# EAGLE design BASIS-RJ45-1.1 (EAGLE 7.4.0)
Selectrix Arduino
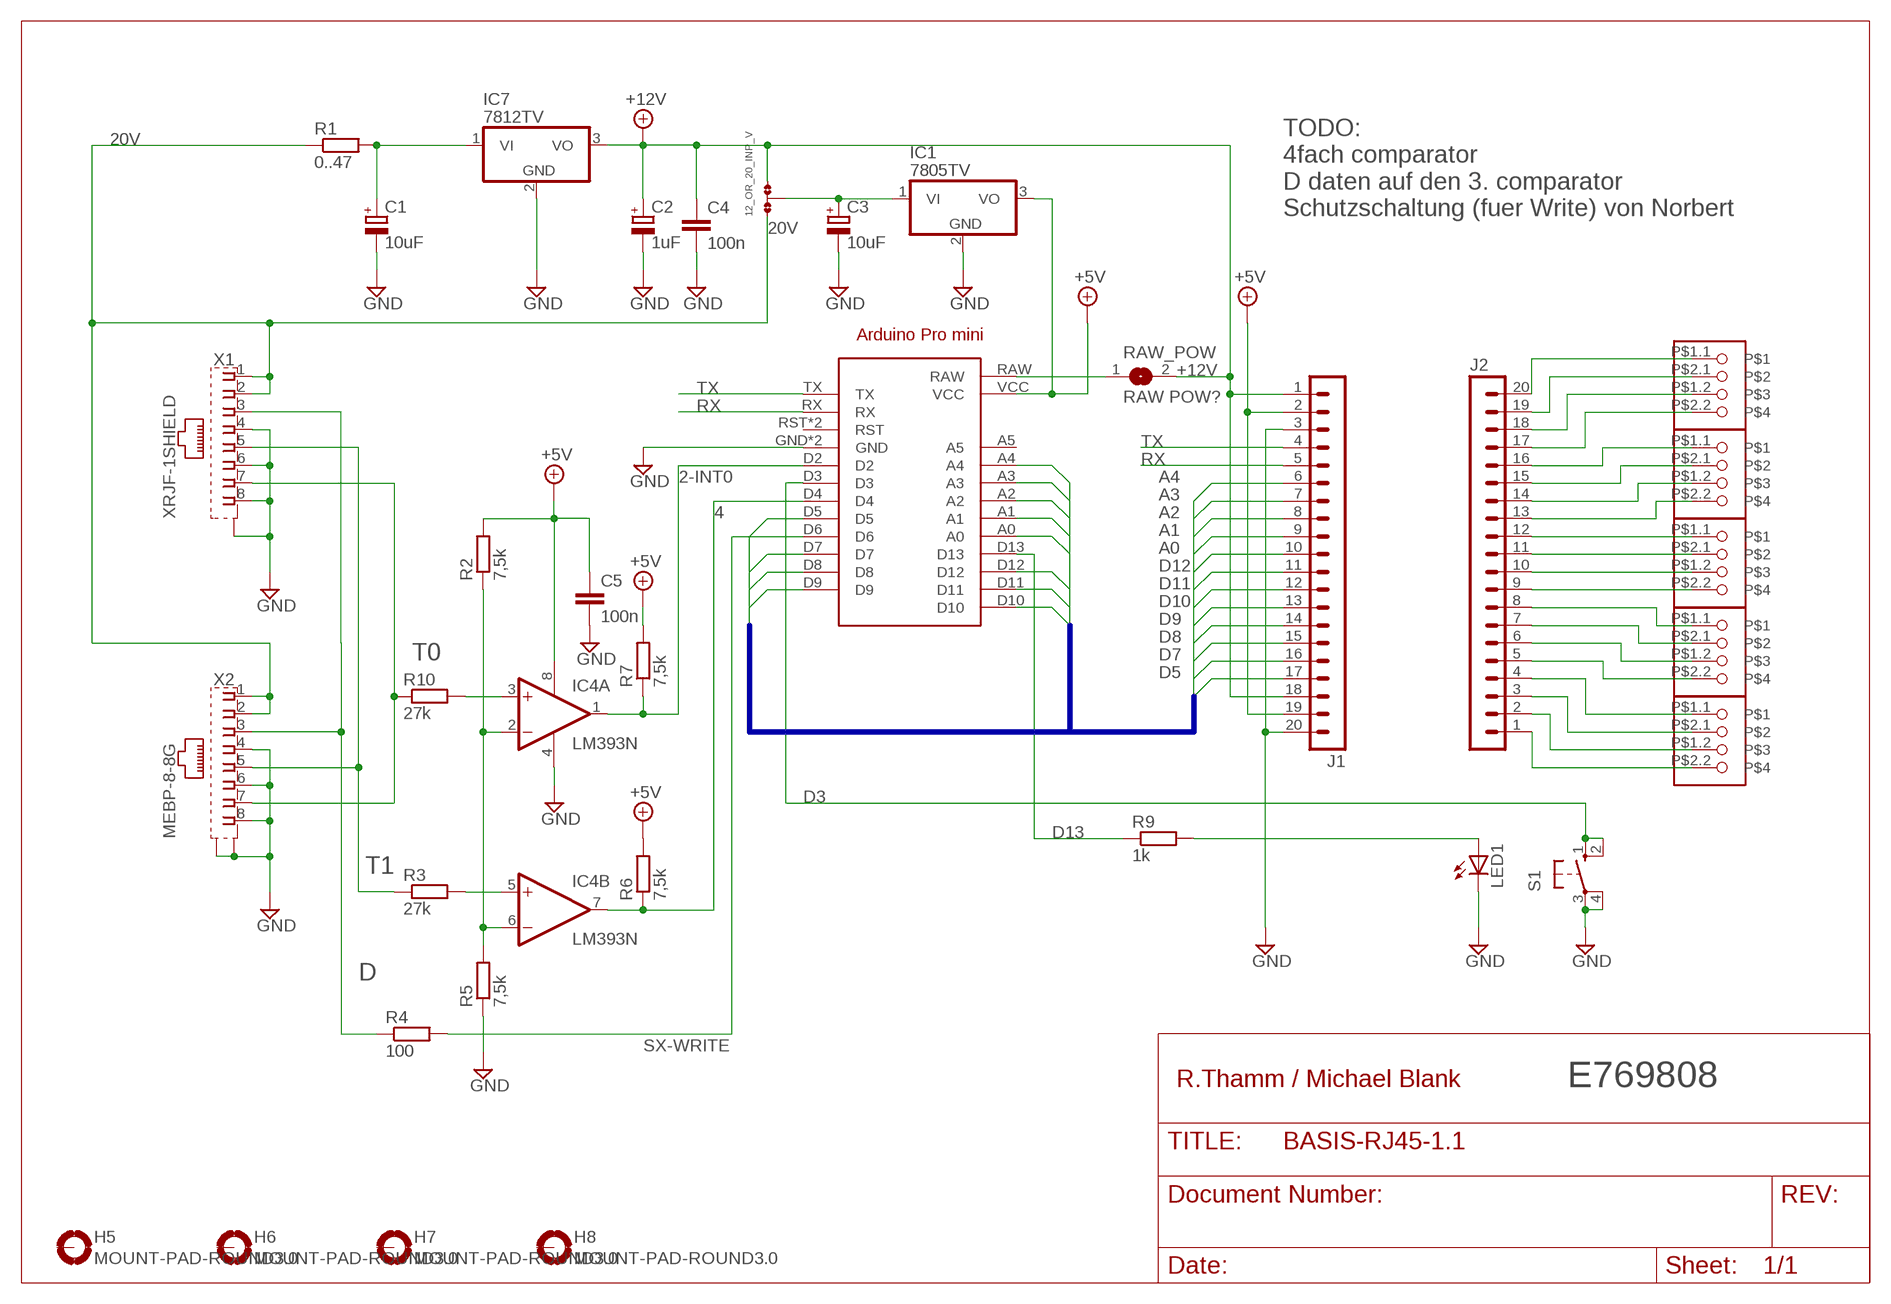
[diagram p0: schematic, sheet 1]

## Parts
A5_RX1  12_OR_20_INP_V  0R-JUMPA  [A0R-JMP]
ARDUINO2  ARDUINO_PRO_MINI  [ARDUINO_PRO_MINI]
C1  10uF  CPOL-EUE2.5-7  [E2,5-7]
C2  1uF  CPOL-EUE2.5-7  [E2,5-7]
C3  10uF  CPOL-EUSMCC  [SMC_C]
C4  100n  C-EU050-025X075  [C050-025X075]
C5  100n  C-EU050-025X075  [C050-025X075]
H5  MOUNT-PAD-ROUND3.0  [3,0-PAD]
H6  MOUNT-PAD-ROUND3.0  [3,0-PAD]
H7  MOUNT-PAD-ROUND3.0  [3,0-PAD]
H8  MOUNT-PAD-ROUND3.0  [3,0-PAD]
IC1  7805TV  [TO220V]
IC4  LM393N  [DIL08]
IC7  7812TV  [TO220V]
J1  MA20-1  [MA20-1]
J2  MA20-1  [MA20-1]
LED1  LED3MM  [LED3MM]
R1  0..47  R-EU_0207/12  [0207/12]
R2  7,5k  R-EU_0207/10  [0207/10]
R3  27k  R-EU_0207/10  [0207/10]
R4  100  R-EU_0207/10  [0207/10]
R5  7,5k  R-EU_0207/10  [0207/10]
R6  7,5k  R-EU_0207/10  [0207/10]
R7  7,5k  R-EU_0207/10  [0207/10]
R9  1k  R-EU_0207/10  [0207/10]
R10  27k  R-EU_0207/10  [0207/10]
RAW_POW  RAW POW?  SJ  [SJ]
S1  10-XX  [B3F-10XX]
U$1  AKL093-06  [AKL093-06]
U$2  AKL093-06  [AKL093-06]
U$3  AKL093-06  [AKL093-06]
U$4  AKL093-06  [AKL093-06]
U$5  AKL093-06  [AKL093-06]
X1  XRJF-1SHIELD  [XRJF-01A-OHNE_LOCH]
X2  MEBP-8-8G  XRJF-01A-0-D2A-010MEBP-8-8G  [XRJF-01A-0-D2A-010]

## Nets
2-INT0: ARDUINO2.D2 IC4.1(A:OUT) R7.1
4: ARDUINO2.D4 IC4.7(B:OUT) R6.1
20V: A5_RX1.1 R1.1 X1.1 X1.2 X2.1 X2.2
+5V: ARDUINO2.VCC C5.1 IC1.3(VO) IC4.8(P:V+) J1.2 J1.19 R2.2 R6.2 R7.2
+12V: A5_RX1.3 C2.+ C4.1 IC7.3(VO) J1.1 J1.18 RAW_POW.2
A0: ARDUINO2.A0 J1.10
A1: ARDUINO2.A1 J1.9
A2: ARDUINO2.A2 J1.8
A3: ARDUINO2.A3 J1.7
A4: ARDUINO2.A4 J1.6
D: R4.1 X1.3 X2.3
D3: ARDUINO2.D3 S1.1(S) S1.2(S1)
D5: ARDUINO2.D5 J1.17
D7: ARDUINO2.D7 J1.16
D8: ARDUINO2.D8 J1.15
D9: ARDUINO2.D9 J1.14
D10: ARDUINO2.D10 J1.13
D11: ARDUINO2.D11 J1.12
D12: ARDUINO2.D12 J1.11
D13: ARDUINO2.D13 R9.1
GND: ARDUINO2.GND ARDUINO2.GND@1(GND) C1.- C2.- C3.- C4.2 C5.2 IC1.2(GND) IC4.4(P:V-) IC7.2(GND) J1.3 J1.20 LED1.K(C) R5.1 S1.3(P) S1.4(P1) X1.4 X1.6 X1.8 X1.S1(S) X2.4 X2.6 X2.8 X2.S1(S) X2.S2(S)
N$1: LED1.A R9.2
N$2: C1.+ IC7.1(VI) R1.2
N$4: IC4.3(A:+IN) R10.2
N$5: IC4.5(B:+IN) R3.2
N$6: J2.1 U$4.P$2.2
N$7: IC4.2(A:-IN) IC4.6(B:-IN) R2.1 R5.2
N$8: J2.2 U$4.P$1.2
N$9: J2.3 U$4.P$2.1
N$10: J2.4 U$4.P$1.1
N$11: J2.5 U$3.P$2.2
N$12: J2.6 U$3.P$1.2
N$13: J2.7 U$3.P$2.1
N$14: J2.8 U$3.P$1.1
N$15: J2.9 U$1.P$2.2
N$16: J2.10 U$1.P$1.2
N$17: J2.11 U$1.P$2.1
N$18: J2.12 U$1.P$1.1
N$19: J2.13 U$2.P$2.2
N$20: J2.14 U$2.P$1.2
N$21: J2.15 U$2.P$2.1
N$22: J2.16 U$2.P$1.1
N$23: J2.17 U$5.P$2.2
N$24: J2.18 U$5.P$1.2
N$25: J2.19 U$5.P$2.1
N$26: J2.20 U$5.P$1.1
N$27: ARDUINO2.RAW RAW_POW.1
N$30: A5_RX1.2 C3.+ IC1.1(VI)
RX: ARDUINO2.RX J1.5
SX-WRITE: ARDUINO2.D6 R4.2
T0: R10.1 X1.7 X2.7
T1: R3.1 X1.5 X2.5
TX: ARDUINO2.TX J1.4
Unconnected: ARDUINO2.A5 ARDUINO2.RST ARDUINO2.RST@1(RST) H5.B3,0(MOUNT) H6.B3,0(MOUNT) H7.B3,0(MOUNT) H8.B3,0(MOUNT)

## Buses
D5,D[7..12],A[0..5]

## Notes on the sheet
- TODO:
  4fach comparator
  D daten auf den 3. comparator
  Schutzschaltung (fuer Write) von Norbert
- R.Thamm / Michael Blank | E769808

## Library data of the parts
A5_RX1 = jump-0r-smd:0R-JUMP: SMD 0R 0805 Jumper
ARDUINO2 = lib-basisplatineSXApmV0102:ARDUINO_PRO_MINI: For creating Arduino Pro Mini shields
C1 C2 = rcl:CPOL-EU: POLARIZED CAPACITOR, European symbol
C3 = resistor:CPOL-EU: POLARIZED CAPACITOR, European symbol
C4 C5 = rcl:C-EU: CAPACITOR, European symbol
H5-H8 = holes:MOUNT-PAD-ROUND: MOUNTING PAD, round
IC1 IC7 = linear:78*: Positive VOLTAGE REGULATOR Source: http://cache.national.com/ds/LM/LM78L05.pdf http://www.fairchildsemi.com/ds/LM/LM7805.pdf
IC4 = linear:LM393: COMPARATOR
J1 J2 = con-lstb:MA20-1: PIN HEADER; OC_FARNELL: unknown; OC_NEWARK: unknown
LED1 = led:LED: LED OSRAM: - CHIPLED LG R971, LG N971, LY N971, LG Q971, LY Q971, LO R971, LY R971 LH N974, LH R974 LS Q976, LO Q976, LY Q976 LO Q996 - Hyper CHIPLED LW Q18S LB Q993, LB Q99A, LB R99A - SideLED LS A670, LO A670, LY A670, LG A670, LP A670 LB A673, LV A673, LT A673, LW A673 LH A674 LY A675 LS A676, LA A676, LO A676, LY A676, LW A676 LS A679, LY A679, LG A679 - Hyper Micro SIDELED® LS Y876, LA Y876, LO Y876, LY Y876 LT Y87S - SmartLED LW L88C, LW L88S LB L89C, LB L89S, LG L890 LS L89K, LO L89K, LY L89K LS L896, LA L896, LO L896, LY L896 - TOPLED LS T670, LO T670, LY T670, LG T670, LP T670 LSG T670, LSP T670, LSY T670, LOP T670, LYG T670 LG T671, LOG T671, LSG T671 LB T673, LV T673, LT T673, LW T673 LH T674 LS T676, LA T676, LO T676, LY T676, LB T676, LH T676, LSB T676, LW T676 LB T67C, LV T67C, LT T67C, LS T67K, LO T67K, LY T67K, LW E67C LS E67B, LA E67B, LO E67B, LY E67B, LB E67C, LV E67C, LT E67C LW T67C LS T679, LY T679, LG T679 LS T770, LO T770, LY T770, LG T770, LP T770 LB T773, LV T773, LT T773, LW T773 LH T774 LS E675, LA E675, LY E675, LS T675 LS T776, LA T776, LO T776, LY T776, LB T776 LHGB T686 LT T68C, LB T68C - Hyper Mini TOPLED® LB M676 - Mini TOPLED Santana® LG M470 LS M47K, LO M47K, LY M47K Source: http://www.osram.convergy.de LUXEON: - LUMILED® LXK2-PW12-R00, LXK2-PW12-S00, LXK2-PW14-U00, LXK2-PW14-V00 LXK2-PM12-R00, LXK2-PM12-S00, LXK2-PM14-U00 LXK2-PE12-Q00, LXK2-PE12-R00, LXK2-PE12-S00, LXK2-PE14-T00, LXK2-PE14-U00 LXK2-PB12-K00, LXK2-PB12-L00, LXK2-PB12-M00, LXK2-PB14-N00, LXK2-PB14-P00, LXK2-PB14-Q00 LXK2-PR12-L00, LXK2-PR12-M00, LXK2-PR14-Q00, LXK2-PR14-R00 LXK2-PD12-Q00, LXK2-PD12-R00, LXK2-PD12-S00 LXK2-PH12-R00, LXK2-PH12-S00 LXK2-PL12-P00, LXK2-PL12-Q00, LXK2-PL12-R00 Source: www.luxeon.com KINGBRIGHT: KA-3528ASYC Source: www.kingbright.com
R1-R7 R9 R10 = rcl:R-EU_: RESISTOR, European symbol
RAW_POW = jumper:SJ: SMD solder JUMPER
S1 = switch-omron:10-XX: OMRON SWITCH; MPN: B3F-1000; OC_FARNELL: 176432; OC_NEWARK: 36M3542
U$1-U$5 = akl093-06-mod:AKL093-06
X1 = con-xmultiple-MB2:XRJF-1SHIELD: RJ45 Modular Buchse, without LED, schielded Source: Reichelt MEBP 8-8G http://cdn-reichelt.de/documents/datenblatt/G100/MEBP8-8G%23IMP.pdf
X2 = con-xmultiple-MB:XRJF: RJ45 Modular Buchse, without LED, schielded Source: Reichelt MEBP 8-8G http://cdn-reichelt.de/documents/datenblatt/G100/MEBP8-8G%23IMP.pdf

## Board
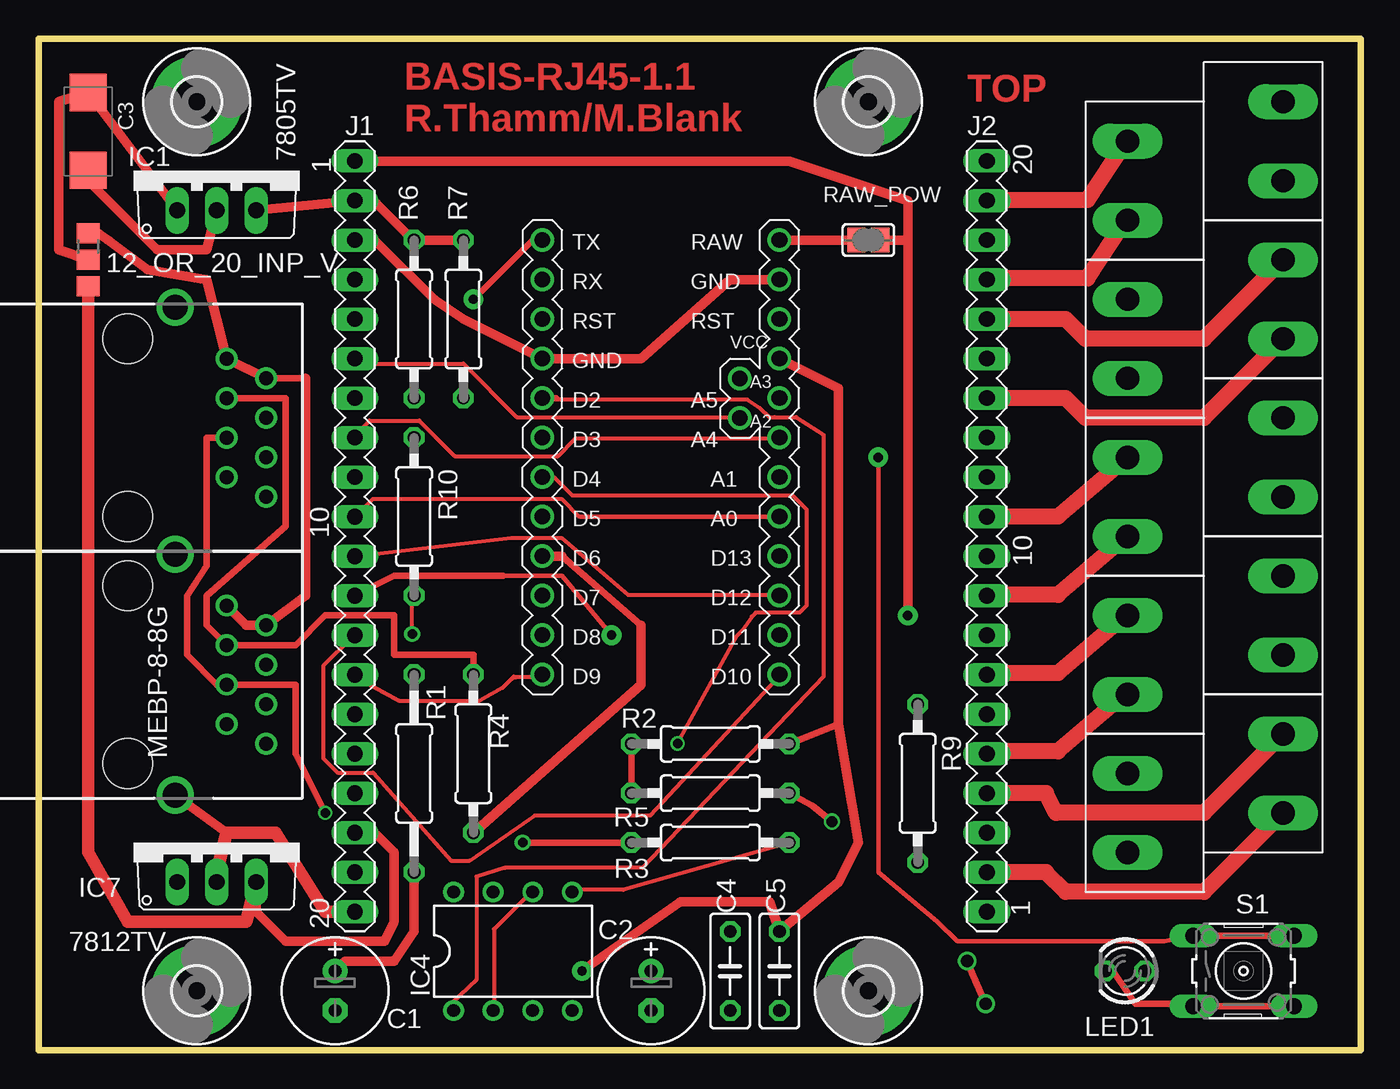
[diagram p1: board, top side]
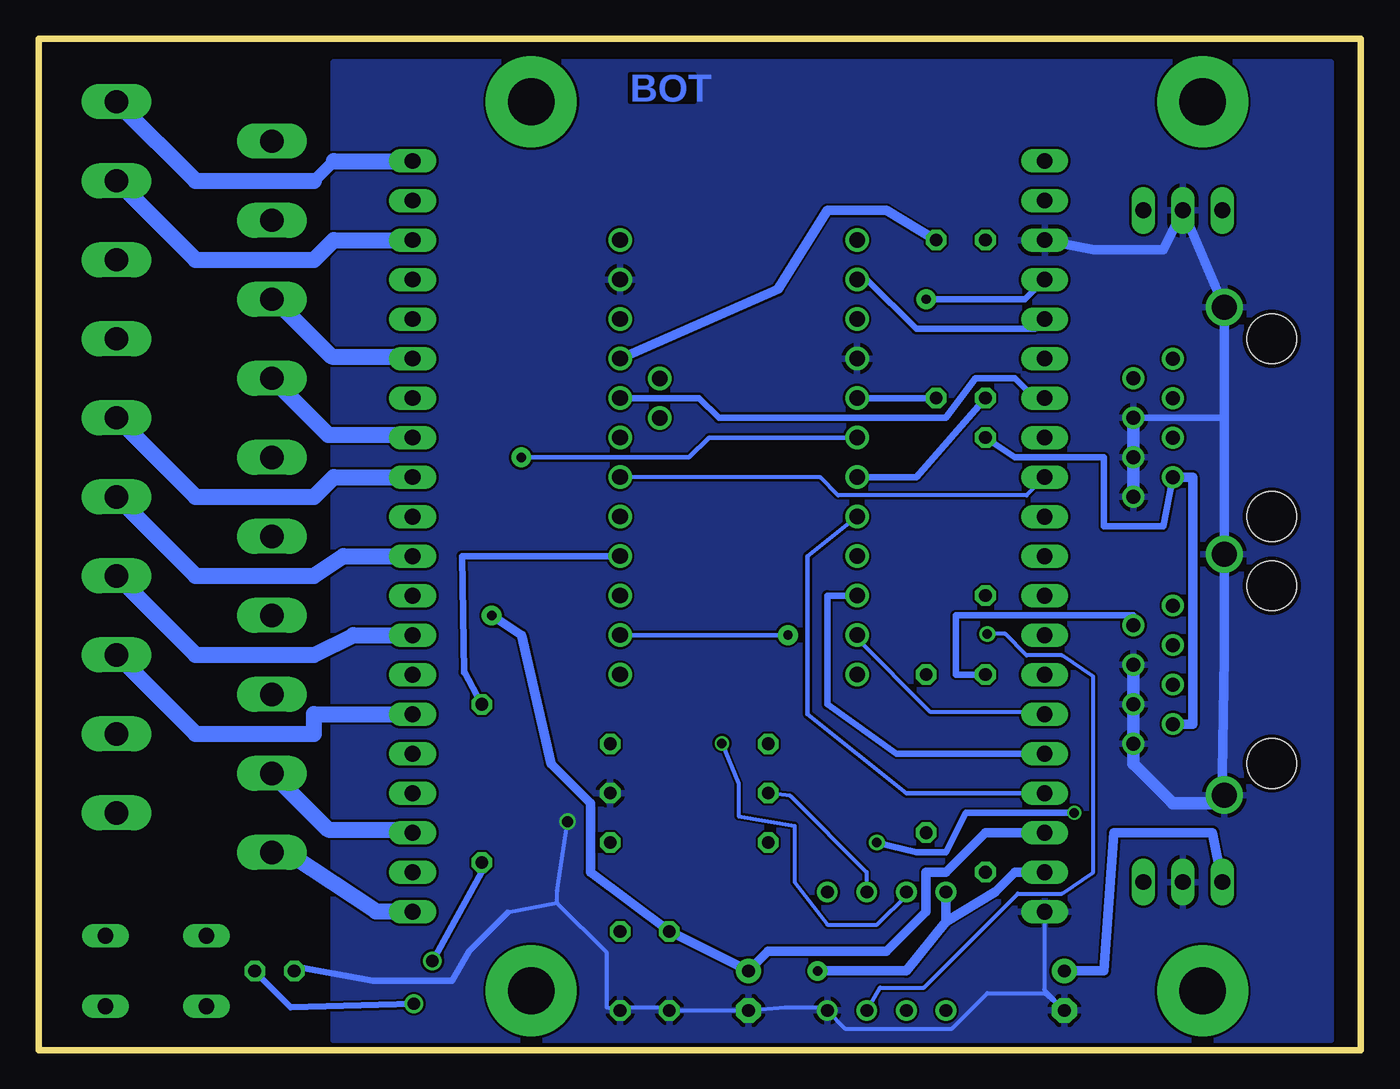
[diagram p2: board, bottom side, seen from below]

Size 85 x 65 mm. Coordinates in mm from the lower left corner, seen from the top.
Outline: 0,0 85,0 85,65 0,65 0,0
Copper layers (1*16): Top 0.035mm / dielectric 1.5mm / Bottom 0.035mm
Design rules "Elecrow_2-layer_eagle_rule": minimum track width 6mil, minimum drill 12mil, track to track 6mil, track to pad 6mil, pad to pad 6mil, via to via 6mil, smd to smd 0mil, copper to edge 10mil, drill to drill 10mil, minimum pad ring 10mil, minimum via ring 6mil, stop-mask expansion 2mil, vias tented up to drill 100mil, thermal gap 10mil

### Footprints (pad centres in the part's own frame; a part is rotated, then mirrored left to right if it is on the bottom)
A0R-JMP = smd 1.5 x 1.3: 1 0,1.7; 2 0,0; 3 0,-1.7
ARDUINO_PRO_MINI = drill 1: A0 11.43,-8.89; A1 11.43,-6.35; A2 11.43,-3.81; A3 11.43,-1.27; A4 8.89,-2.54; A5 8.89,0; D2 -3.81,-1.27; D3 -3.81,-3.81; D4 -3.81,-6.35; D5 -3.81,-8.89; D6 -3.81,-11.43; D7 -3.81,-13.97; D8 -3.81,-16.51; D9 -3.81,-19.05; D10 11.43,-19.05; D11 11.43,-16.51; D12 11.43,-13.97; D13 11.43,-11.43; GND -3.81,1.27; GND@1 11.43,6.35; RAW 11.43,8.89; RST 11.43,3.81; RST@1 -3.81,3.81; RX -3.81,6.35; TX -3.81,8.89; VCC 11.43,1.27
E2,5-7 = drill 0.813 pad 1.6: + -1.27,0 | drill 0.813 pad 1.6 octagon: - 1.27,0
SMC_C = smd 2.4 x 2.4: + -2.5,0; - 2.5,0
C050-025X075 = drill 0.813 octagon: 1 -2.54,0; 2 2.54,0
3,0-PAD = drill 3 pad 5.842: B3,0 0,0
TO220V = drill 1.016 long: 1 -2.54,-2.54; 2 0,-2.54; 3 2.54,-2.54
DIL08 = drill 0.813 pad 1.27: 1 -3.81,-3.81; 2 -1.27,-3.81; 3 1.27,-3.81; 4 3.81,-3.81; 5 3.81,3.81; 6 1.27,3.81; 7 -1.27,3.81; 8 -3.81,3.81
MA20-1 = drill 1.016 long: 1 -24.13,0; 2 -21.59,0; 3 -19.05,0; 4 -16.51,0; 5 -13.97,0; 6 -11.43,0; 7 -8.89,0; 8 -6.35,0; 9 -3.81,0; 10 -1.27,0; 11 1.27,0; 12 3.81,0; 13 6.35,0; 14 8.89,0; 15 11.43,0; 16 13.97,0; 17 16.51,0; 18 19.05,0; 19 21.59,0; 20 24.13,0
LED3MM = drill 0.813 octagon: A -1.27,0; K 1.27,0
0207/12 = drill 0.813 octagon: 1 -6.35,0; 2 6.35,0
0207/10 = drill 0.813 octagon: 1 -5.08,0; 2 5.08,0
SJ = smd 1.168 x 1.6: 1 -0.762,0; 2 0.762,0
B3F-10XX = drill 1.016 long: 1 -3.251,2.261; 2 3.251,2.261; 3 -3.251,-2.261; 4 3.251,-2.261
AKL093-06 = drill 1.5 pad 2.184 long: P$1.1 -5.08,-6.35; P$1.2 -5.08,-1.27; P$2.1 4.92,-3.81; P$2.2 4.92,1.27
XRJF-01A-OHNE_LOCH = drill 0.9 pad 1.27: 1 -4.445,6.35; 2 -3.175,8.89; 3 -1.905,6.35; 4 -0.635,8.89; 5 0.635,6.35; 6 1.905,8.89; 7 3.175,6.35; 8 4.445,8.89 | drill 1.6 pad 2.184: S1 -7.745,3.05 | hole 3.2: -5.715,0; 5.715,0
XRJF-01A-0-D2A-010 = drill 0.9 pad 1.27: 1 -4.445,6.35; 2 -3.175,8.89; 3 -1.905,6.35; 4 -0.635,8.89; 5 0.635,6.35; 6 1.905,8.89; 7 3.175,6.35; 8 4.445,8.89 | drill 1.6 pad 2.184: S1 -7.745,3.05; S2 7.745,3.05 | hole 3.2: -5.715,0; 5.715,0

### Placement (x,y rotation side)
A5_RX1  3.17,50.8 0 top
ARDUINO2  36.2,43.18 0 top
C1  19.05,3.81 270 top
C2  39.37,3.81 270 top
C3  3.17,59.05 270 top
C4  44.45,5.08 270 top
C5  47.62,5.08 270 top
H5  10.16,60.96 0 top
H6  53.34,60.96 0 top
H7  10.16,3.81 0 top
H8  53.34,3.81 0 top
IC1  11.43,56.52 0 top
IC4  30.48,6.35 0 top
IC7  11.43,13.34 0 top
J1  20.32,33.02 270 top
J2  60.96,33.02 90 top
LED1  69.85,5.08 180 top
R1  24.13,17.78 270 top
R2  43.18,19.68 0 top
R3  43.18,13.34 0 top
R4  27.94,19.05 270 top
R5  43.18,16.51 180 top
R6  24.13,46.99 90 top
R7  27.3,46.99 90 top
R9  56.52,17.14 270 top
R10  24.13,34.29 270 top
RAW_POW  53.34,52.07 0 top
S1  77.47,5.08 0 top
U$1  74.93,34.29 180 top
U$2  74.93,44.45 180 top
U$3  74.93,24.13 180 top
U$4  74.93,13.97 180 top
U$5  74.93,54.61 180 top
X1  5.71,40.01 270 top
X2  5.71,24.13 270 top

### Tracks (layer width: path | path; a pad name or v marks a point on that pad's centre or on a via)
2-INT0
  Top 0.152: 32.51,41.91 ARDUINO2.D2 | 33.27,41.91 33.27,41.83
  Top 0.254: 33.15,41.83 33.27,41.83 45.54,41.83 46.35,41.27 46.99,40.69 47.32,40.69 48.69,40.69 50.47,39.55 50.47,24 38.81,11.71 29.97,11.71 28.14,11.15 28.14,4.52 26.52,2.97 26.52,2.74 IC4.1
  Top 0.406: 33.27,41.91 32.51,41.91
  Bottom 0.406: R7.1 ARDUINO2.D2
4  (via drill 0.61)
  Top 0.152: 32.51,36.83 ARDUINO2.D4
  Top 0.254: v41.07,19.71 44.88,26.62 45.21,26.95 45.85,27.86 46.1,28.12 48.92,28.12 49.38,28.57 49.38,34.75 48.46,35.66 34.29,35.66 33.2,36.75 33.15,36.8
  Top 0.305: 32.51,36.83 32.64,36.83 33.2,36.75
  Bottom 0.254: v41.07,19.71 40.01,17.14 40.01,15.04 36.4,14.4 36.4,10.79 34.29,8.05 31.09,8.05 29.08,10.06 29.26,10.06 IC4.7
  Bottom 0.406: ARDUINO2.D4 28.57,36.83 R6.1
20V
  Top 0.406: X1.2 17.14,43.18
  Top 0.61: X2.1 13.34,27.3 X2.2 17.14,29.21 17.14,43.18 | A5_RX1.1 3.81,52.5 4.45,52.07 6.99,50.16 10.79,49.53 X1.1 X1.2
  Bottom 0.406: R1.1 26.04,24.13 26.04,27.94 14.61,27.94 X2.2
+5V  (via drill 0.6 pad 1.27)
  Top 0.254: 24,52.12 R6.2
  Top 0.406: R2.2 51.44,20.95
  Top 0.61: 24,52.12 21.72,54.41 20.98,54.41 J1.2 IC1.3 | ARDUINO2.VCC 51.44,42.55 51.44,20.95 52.7,13.34 51.44,10.79 C5.1 46.99,9.53 41.27,9.53 v34.92,5.08 | R6.2 R7.2
  Bottom 0.61: J1.19 22.23,11.43 23.5,10.16 26.67,8.26 | 26.67,8.26 IC4.8 26.67,8.26 | ARDUINO2.VCC 37.47,48.9 34.29,53.98 30.48,53.98 R7.2 | 26.67,8.26 29.21,5.08 v34.92,5.08
+12V  (via drill 0.6 pad 1.27)
  Top 0.61: J1.18 21.59,13.97 22.86,12.7 22.86,8.26 22.23,6.99 15.88,6.99 13.97,8.89 IC7.3 | J1.1 48.26,57.15 55.88,54.61 55.88,52.07 | 55.88,52.07 55.88,50.8 | 55.88,50.8 55.88,35.56 v55.88,27.94 | RAW_POW.2 55.88,52.07 | 55.88,52.07 55.88,50.8
  Top 0.813: A5_RX1.3 3.17,12.7 5.71,8.26 13.34,8.26 IC7.3
  Bottom 0.61: J1.18 24.13,13.97 26.67,11.43 27.94,11.43 27.94,8.89 30.48,6.35 38.1,6.35 C2.+ C4.1 49.53,11.43 49.53,15.88 52.07,18.41 53.98,26.67 v55.88,27.94
A0
  Top 0.152: 47.5,34.29 ARDUINO2.A0 | 34.8,34.29 34.75,34.29
  Top 0.254: 34.75,34.29 33.6,35.43 21.49,35.43 20.34,34.29 J1.10
  Top 0.305: 34.8,34.29 47.5,34.29
A1
  Bottom 0.152: ARDUINO2.A1 47.75,36.83 47.75,36.8
  Bottom 0.254: 48.23,36.8 47.75,36.8 34.75,36.8 33.6,35.66 21.49,35.66 J1.9
A2
  Top 0.152: ARDUINO2.A2 47.75,39.37 47.75,39.32
  Top 0.254: 47.62,39.32 47.75,39.32 34.52,39.32 33.38,38.18 26.75,38.18 24.46,40.46 21.26,40.46 20.34,39.55 J1.8 | 47.62,39.32 ARDUINO2.A2 47.62,39.32 | 47.62,39.32 48.23,39.32
A3
  Bottom 0.406: J1.7 20.95,41.91 22.23,43.18 24.77,43.18 26.67,40.64 29.84,40.64 41.27,40.64 42.55,41.91 ARDUINO2.A3
A4
  Top 0.152: ARDUINO2.A4 45.21,40.64 44.58,40.69
  Top 0.254: 45.09,40.69 44.58,40.69 30.73,40.69 27.3,44.12 20.57,44.12 20.34,44.35 J1.6
D
  Top 0.406: R4.1 27.94,25.4 22.86,25.4 22.86,27.94 18.41,27.94 16.51,26.04 X2.3 10.79,27.3 10.79,29.21 15.88,33.66 15.88,41.91 X1.3
D3  (via drill 0.6 pad 1.27)
  Top 0.305: v53.98,38.1 53.98,11.43 57.78,8.26 59.05,6.99 72.39,6.99 S1.1
  Top 0.406: S1.1 S1.2
  Bottom 0.305: ARDUINO2.D3 41.91,39.37 43.18,38.1 v53.98,38.1
D5
  Bottom 0.305: ARDUINO2.D5 35.56,31.75 35.56,21.59 29.21,16.51 J1.17
D7
  Bottom 0.406: J1.16 29.84,19.05 34.29,22.23 34.29,29.21 ARDUINO2.D7
D8
  Bottom 0.152: ARDUINO2.D8 32.51,26.67 32.51,26.42 32.44,26.49
  Bottom 0.254: 32.92,26.52 32.46,26.52 32.44,26.49 27.66,21.72 20.34,21.72 J1.15
D9
  Top 0.152: ARDUINO2.D9 32.26,24.13 ARDUINO2.D9 | ARDUINO2.D9 30.48,23.88 29.81,23.28
  Top 0.254: 32.92,24 30.53,24 29.81,23.28 28.35,22.45 23.16,22.45 20.34,24 J1.14
D10
  Top 0.152: 47.75,24.13 47.37,23.88 47.42,23.82
  Top 0.254: 47.6,24 47.42,23.82 39.32,15.09 31.9,15.09 27.71,12.17 26.52,12.17 21.49,17.83 19.2,17.83 18.29,18.75 18.29,24.69 20.12,26.52 J1.13
  Top 0.406: 47.75,24.13 ARDUINO2.D10
D11  (via drill 0.6 pad 1.27)
  Top 0.305: 29.84,30.48 33.66,30.48 v36.83,26.67
  Top 0.406: J1.12 22.86,30.48 29.84,30.48
  Bottom 0.305: v36.83,26.67 ARDUINO2.D11
D12
  Top 0.152: ARDUINO2.D12 47.75,29.21 47.75,29.26
  Top 0.254: 47.6,29.26 37.9,29.26 33.6,32.92 30.38,32.92 J1.11 | 47.6,29.26 47.75,29.26 47.6,29.26
D13
  Bottom 0.406: R9.1 57.66,24.33 57.66,24.26 57.78,31.75 ARDUINO2.D13
GND  (via drill 0.7)
  Top 0.254: 68.58,5.03 LED1.K 68.58,5.26 | 74.07,2.97 S1.3
  Top 0.406: 68.58,5.03 69.09,5.03 70.51,2.97 74.07,2.97 S1.3 S1.4 | v51,14.68 49.73,15.7 R5.1
  Top 0.61: J1.3 21.59,52.07 25.4,48.26 27.3,46.99 ARDUINO2.GND 38.73,44.45 44.45,49.53 ARDUINO2.GND@1 | 12.06,13.97 X2.S2 | C3.- 3.17,55.88 7.62,51.44 10.79,51.44 IC1.2
  Top 0.813: IC7.2 11.43,11.43 12.06,13.97 15.24,13.97 18.41,8.89 J1.20
  Bottom 0.254: 51.66,9.45 54.86,8.81 | 51.66,9.45 48.46,6.25 48.46,2.74 C5.2 47.6,2.74 45.21,2.74 C4.2 44.35,2.52 39.32,2.52 39.45,2.39 C2.- 37.03,2.74 34.29,2.74 IC4.4 34.29,2.52 33.15,1.37 26.29,1.37 24,3.66 20.34,3.66 C1.- 20.34,3.89 20.34,8.69 J1.20 | v51,14.68 51.66,10.21 51.66,9.45
  Bottom 0.406: X1.4 8.77,40.64 X1.S1 | LED1.K 68.58,5.26 67.94,5.26 63.5,4.45 58.42,4.45 57.33,6.35 54.86,8.81
  Bottom 0.61: 8.77,40.52 8.77,40.64 X1.S1 IC1.2 12.7,51.44 17.14,51.44 J1.3 | 8.77,40.52 X2.S1 | 8.77,40.52 8.77,25.27 8.89,17.78 8.89,16.51 X2.S2
  Bottom 0.813: X2.4 X2.6 X2.8 14.61,18.41 12.06,15.88 9.28,15.88 X2.S2 | X1.4 X1.6 | X1.6 X1.8 X1.6
  pour Bottom: 1.91,63.5 66.04,63.5 66.04,0.64 1.91,0.64
N$1  (via drill 0.8, 0.8 pad 0.81)
  Top 0.406: v60.88,2.97 v59.69,5.71
  Bottom 0.254: 71.09,5.03 LED1.A
  Bottom 0.406: v60.88,2.97 68.81,2.74 71.09,5.03 | v59.69,5.71 56.52,11.43 R9.2
N$2
  Top 0.254: 19.15,5.16 19.1,5.16 C1.+ | 24,11.43 R1.2
  Top 0.61: 24,11.43 24.13,11.3 24.13,7.62 22.86,5.71 19.68,5.71 C1.+
  Bottom 0.61: IC7.1 9.53,13.97 15.88,13.97 16.51,5.08 C1.+
N$4  (via drill 0.61 pad 1.02)
  Top 0.254: v24,26.75 24,29.03 R10.2
  Bottom 0.254: v24,26.75 22.86,26.75 21.49,25.38 19.2,25.38 17.2,24 17.2,11.43 19.2,10.06 22.05,10.06 28.09,4.01 30.91,4.01 IC4.3
N$5
  Top 0.254: R3.2 37.59,10.29 34.29,10.29 IC4.5
N$6
  Bottom 0.254: 61.04,8.91 J2.1 | 69.83,12.57 U$4.P$2.2
  Bottom 1.016: 61.04,8.91 63.32,8.91 68.89,12.57 69.83,12.57
N$7
  Top 0.254: IC4.2 29.26,2.74 29.26,7.77 31.55,10.06 IC4.6
  Top 0.406: R5.2 R2.1
  Bottom 0.254: IC4.6 31.77,10.29 31.77,11.43 36.68,16.33 R5.2
N$8
  Top 1.016: U$4.P$1.2 74.93,10.16 66.04,10.16 64.77,11.43 J2.2
N$9
  Bottom 0.254: 61.04,14.17 J2.3 | 69.83,17.6 U$4.P$2.1
  Bottom 1.016: 61.04,14.17 66.4,14.17 69.83,17.6
N$10
  Top 1.016: U$4.P$1.1 74.93,15.24 65.41,15.24 64.77,16.51 J2.4
N$11
  Top 0.254: 61.04,19.2 J2.5 | 69.83,22.86 U$3.P$2.2
  Top 1.016: 61.04,19.2 65.53,19.2 69.83,22.86
N$12
  Bottom 1.016: U$3.P$1.2 74.93,20.32 67.31,20.32 67.31,21.59 J2.6
N$13
  Top 0.254: 61.04,24.23 J2.7 | 69.83,27.89 U$3.P$2.1
  Top 1.016: 61.04,24.23 65.53,24.23 69.83,27.89
N$14
  Bottom 1.016: U$3.P$1.1 74.93,25.4 67.31,25.4 64.77,26.67 J2.8
N$15
  Top 0.254: 61.04,29.26 J2.9 | 69.83,32.92 U$1.P$2.2
  Top 1.016: 61.04,29.26 65.53,29.26 69.83,32.92
N$16
  Bottom 1.016: U$1.P$1.2 74.93,30.48 67.31,30.48 65.41,31.75 J2.10
N$17
  Top 0.254: 69.83,37.95 U$1.P$2.1
  Top 1.016: J2.11 65.53,34.29 69.83,37.95
N$18
  Bottom 1.016: U$1.P$1.1 74.93,35.56 67.31,35.56 66.04,36.83 J2.12
N$19
  Bottom 0.254: 61.04,39.55 J2.13 | 69.83,42.98 U$2.P$2.2
  Bottom 1.016: 61.04,39.55 66.4,39.55 69.83,42.98
N$20
  Top 1.016: U$2.P$1.2 74.93,40.64 67.31,40.64 66.04,41.91 J2.14
N$21
  Bottom 0.254: 61.04,44.58 J2.15 | 69.83,48.23 U$2.P$2.1
  Bottom 1.016: 61.04,44.58 66.17,44.58 69.83,48.23
N$22
  Top 1.016: U$2.P$1.1 74.93,45.72 67.31,45.72 66.04,46.99 J2.16
N$23
  Top 0.254: 61.04,49.61 J2.17 | 69.83,53.26 U$5.P$2.2
  Top 1.016: 61.04,49.61 67.44,49.61 69.83,53.26
N$24
  Bottom 1.016: U$5.P$1.2 74.93,50.8 67.31,50.8 66.04,52.07 J2.18
N$25
  Top 0.254: 61.04,54.63 J2.19 | 69.83,58.29 U$5.P$2.1
  Top 1.016: 61.04,54.63 67.44,54.63 69.83,58.29
N$26
  Bottom 0.254: 79.88,60.81 U$5.P$1.1
  Bottom 0.406: 79.88,60.81 79.86,60.81
  Bottom 0.813: 67.31,55.88 66.04,57.15
  Bottom 1.016: 79.86,60.81 74.93,55.88 67.31,55.88 | 66.04,57.15 J2.20
N$27
  Top 0.152: 47.75,52.07 ARDUINO2.RAW
  Top 0.61: 47.75,52.07 RAW_POW.1
N$30
  Top 0.61: A5_RX1.2 1.27,51.44 1.27,60.96 C3.+ IC1.1
RX
  Bottom 0.406: ARDUINO2.RX 31.75,49.53 28.57,46.35 20.95,46.35 J1.5
SX-WRITE
  Top 0.406: 38.73,27.3 33.66,31.75
  Top 0.61: R4.2 38.73,23.5 38.73,27.3 | 33.66,31.75 ARDUINO2.D6
T0
  Bottom 0.406: R10.1 22.23,38.1 16.51,38.1 16.51,33.66 12.7,33.66 X1.7
  Bottom 0.61: X2.7 10.79,20.95 10.79,36.83 X1.7
T1  (via drill 0.6, 0.6 pad 1.02)
  Top 0.406: R3.1 v31.11,13.34 | v18.41,15.24 16.51,19.05 16.51,23.5 X2.5 11.43,23.5 9.53,25.4 9.53,29.21 10.79,31.11 10.79,36.2 10.79,39.37 X1.5
  Bottom 0.406: v31.11,13.34 28.57,12.7 26.67,12.7 25.4,15.24 v18.41,15.24
TX  (via drill 0.6 pad 1.27)
  Top 0.152: 32.26,52.07 ARDUINO2.TX
  Top 0.305: 31.75,52.07 32.26,52.07
  Top 0.406: 31.75,52.07 v27.94,48.26
  Bottom 0.406: v27.94,48.26 21.59,48.26 J1.4

### Text on the board
Top: TOP | BASIS-RJ45-1.1 / R.Thamm/M.Blank
Bottom: BOT